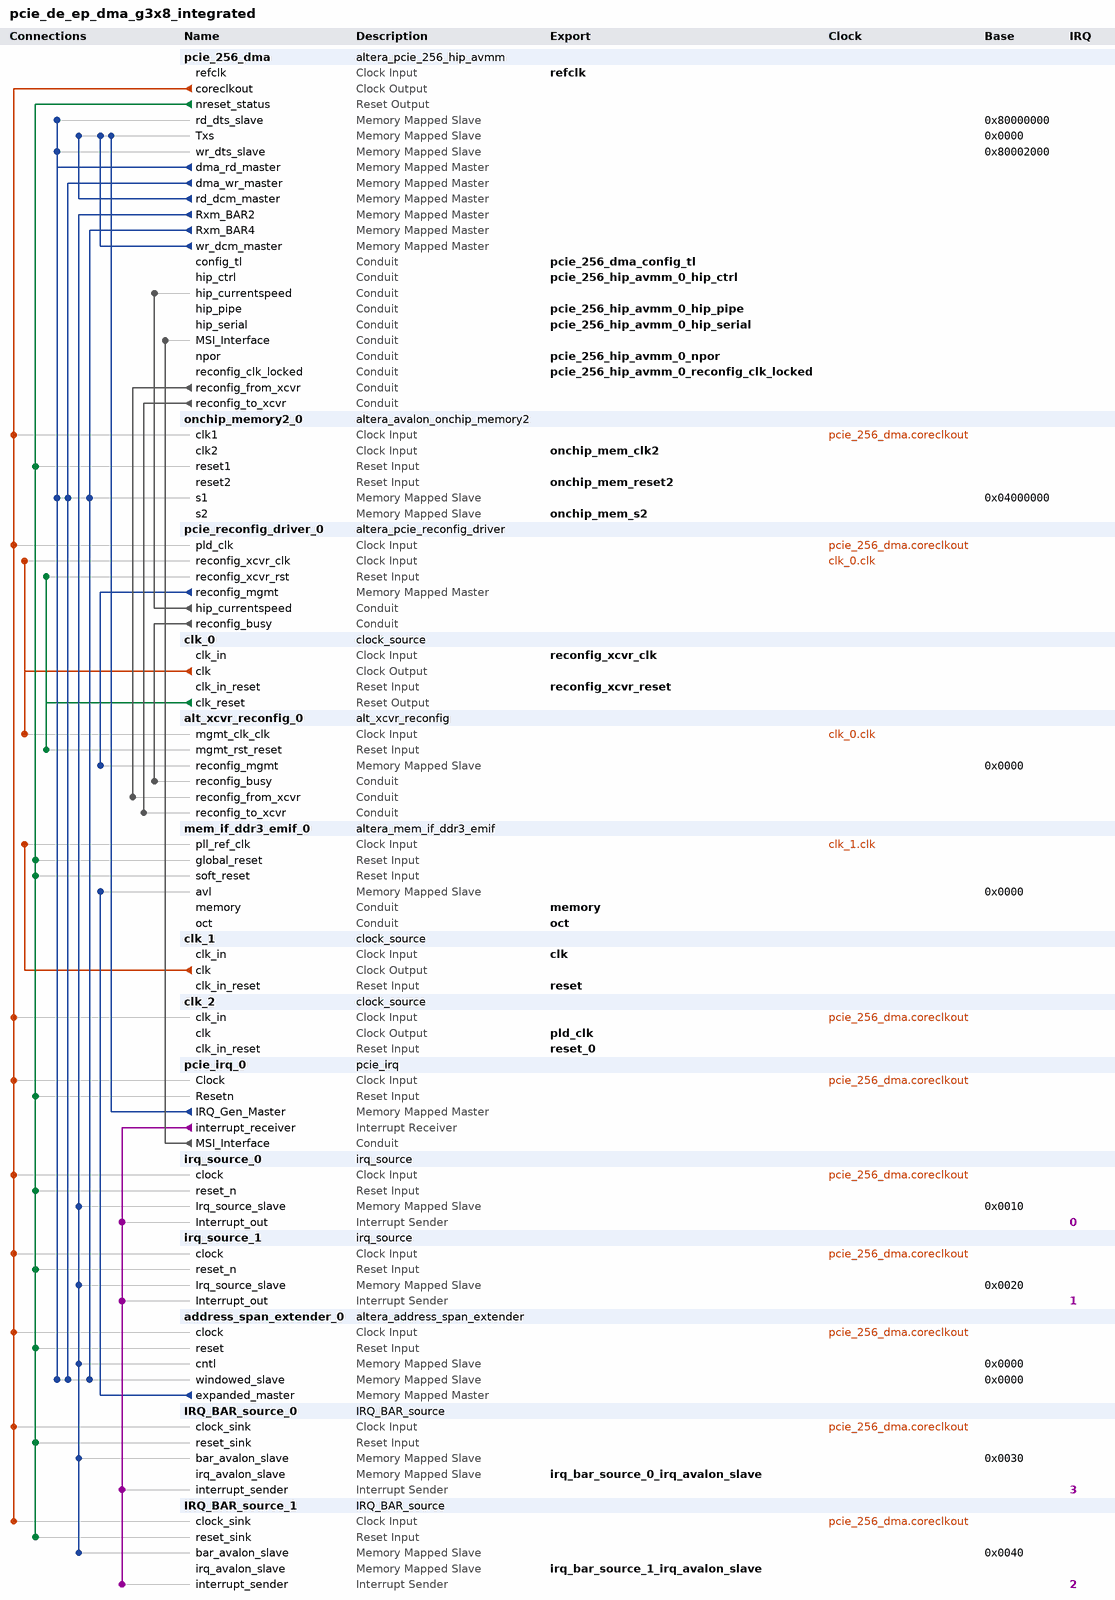
[diagram p0: system contents]
# Platform Designer (Qsys) system pcie_de_ep_dma_g3x8_integrated, Stratix V 5SGSMD5K2F40C2
# Parameters at their usual value, and those the tool derives, are not listed.
package require -exact qsys 17.0
create_system pcie_de_ep_dma_g3x8_integrated
set_project_property DEVICE_FAMILY {Stratix V}
set_project_property DEVICE 5SGSMD5K2F40C2

add_instance pcie_256_dma altera_pcie_256_hip_avmm 17.0
set_instance_parameter_value pcie_256_dma CB_P2A_AVALON_ADDR_B0 0x00000000
set_instance_parameter_value pcie_256_dma CB_P2A_AVALON_ADDR_B1 0x00000000
set_instance_parameter_value pcie_256_dma CB_P2A_AVALON_ADDR_B2 0x00000000
set_instance_parameter_value pcie_256_dma CB_P2A_AVALON_ADDR_B3 0x00000000
set_instance_parameter_value pcie_256_dma CB_P2A_AVALON_ADDR_B4 0x00000000
set_instance_parameter_value pcie_256_dma CB_P2A_AVALON_ADDR_B5 0x00000000
set_instance_parameter_value pcie_256_dma CB_P2A_FIXED_AVALON_ADDR_B0 0
set_instance_parameter_value pcie_256_dma CB_P2A_FIXED_AVALON_ADDR_B1 0
set_instance_parameter_value pcie_256_dma CB_P2A_FIXED_AVALON_ADDR_B2 0
set_instance_parameter_value pcie_256_dma CB_P2A_FIXED_AVALON_ADDR_B3 0
set_instance_parameter_value pcie_256_dma CB_P2A_FIXED_AVALON_ADDR_B4 0
set_instance_parameter_value pcie_256_dma CB_P2A_FIXED_AVALON_ADDR_B5 0
set_instance_parameter_value pcie_256_dma CG_COMMON_CLOCK_MODE 1
set_instance_parameter_value pcie_256_dma CG_RXM_IRQ_NUM 16
set_instance_parameter_value pcie_256_dma NUM_PREFETCH_MASTERS 1
set_instance_parameter_value pcie_256_dma RD_SLAVE_ADDRESS_MAP 32
set_instance_parameter_value pcie_256_dma SLAVE_ADDRESS_MAP_0 0
set_instance_parameter_value pcie_256_dma SLAVE_ADDRESS_MAP_1 0
set_instance_parameter_value pcie_256_dma SLAVE_ADDRESS_MAP_2 7
set_instance_parameter_value pcie_256_dma SLAVE_ADDRESS_MAP_3 0
set_instance_parameter_value pcie_256_dma SLAVE_ADDRESS_MAP_4 27
set_instance_parameter_value pcie_256_dma SLAVE_ADDRESS_MAP_5 0
set_instance_parameter_value pcie_256_dma TX_S_ADDR_WIDTH 32
set_instance_parameter_value pcie_256_dma WR_SLAVE_ADDRESS_MAP 27
set_instance_parameter_value pcie_256_dma add_pll_to_hip_coreclkout 0
set_instance_parameter_value pcie_256_dma advanced_default_hwtcl_atomic_malformed true
set_instance_parameter_value pcie_256_dma advanced_default_hwtcl_atomic_op_completer_32bit false
set_instance_parameter_value pcie_256_dma advanced_default_hwtcl_atomic_op_completer_64bit false
set_instance_parameter_value pcie_256_dma advanced_default_hwtcl_atomic_op_routing false
set_instance_parameter_value pcie_256_dma advanced_default_hwtcl_bridge_port_ssid_support false
set_instance_parameter_value pcie_256_dma advanced_default_hwtcl_bridge_port_vga_enable false
set_instance_parameter_value pcie_256_dma advanced_default_hwtcl_bypass_cdc false
set_instance_parameter_value pcie_256_dma advanced_default_hwtcl_cas_completer_128bit false
set_instance_parameter_value pcie_256_dma advanced_default_hwtcl_cdc_dummy_insert_limit 11
set_instance_parameter_value pcie_256_dma advanced_default_hwtcl_d0_pme false
set_instance_parameter_value pcie_256_dma advanced_default_hwtcl_d1_pme false
set_instance_parameter_value pcie_256_dma advanced_default_hwtcl_d1_support false
set_instance_parameter_value pcie_256_dma advanced_default_hwtcl_d2_pme false
set_instance_parameter_value pcie_256_dma advanced_default_hwtcl_d2_support false
set_instance_parameter_value pcie_256_dma advanced_default_hwtcl_d3_cold_pme false
set_instance_parameter_value pcie_256_dma advanced_default_hwtcl_d3_hot_pme false
set_instance_parameter_value pcie_256_dma advanced_default_hwtcl_data_pack_rx disable
set_instance_parameter_value pcie_256_dma advanced_default_hwtcl_deskew_comma com_deskw
set_instance_parameter_value pcie_256_dma advanced_default_hwtcl_device_number 0
set_instance_parameter_value pcie_256_dma advanced_default_hwtcl_disable_link_x2_support false
set_instance_parameter_value pcie_256_dma advanced_default_hwtcl_disable_snoop_packet false
set_instance_parameter_value pcie_256_dma advanced_default_hwtcl_ei_delay_powerdown_count 10
set_instance_parameter_value pcie_256_dma advanced_default_hwtcl_eie_before_nfts_count 4
set_instance_parameter_value pcie_256_dma advanced_default_hwtcl_enable_adapter_half_rate_mode false
set_instance_parameter_value pcie_256_dma advanced_default_hwtcl_enable_l1_aspm false
set_instance_parameter_value pcie_256_dma advanced_default_hwtcl_enable_rx_buffer_checking false
set_instance_parameter_value pcie_256_dma advanced_default_hwtcl_extended_format_field false
set_instance_parameter_value pcie_256_dma advanced_default_hwtcl_extended_tag_reset false
set_instance_parameter_value pcie_256_dma advanced_default_hwtcl_fc_init_timer 1024
set_instance_parameter_value pcie_256_dma advanced_default_hwtcl_flow_control_timeout_count 200
set_instance_parameter_value pcie_256_dma advanced_default_hwtcl_flow_control_update_count 30
set_instance_parameter_value pcie_256_dma advanced_default_hwtcl_flr_capability false
set_instance_parameter_value pcie_256_dma advanced_default_hwtcl_gen2_diffclock_nfts_count 255
set_instance_parameter_value pcie_256_dma advanced_default_hwtcl_gen2_sameclock_nfts_count 255
set_instance_parameter_value pcie_256_dma advanced_default_hwtcl_hot_plug_support 0
set_instance_parameter_value pcie_256_dma advanced_default_hwtcl_interrupt_pin inta
set_instance_parameter_value pcie_256_dma advanced_default_hwtcl_l01_entry_latency 31
set_instance_parameter_value pcie_256_dma advanced_default_hwtcl_l0_exit_latency_diffclock 6
set_instance_parameter_value pcie_256_dma advanced_default_hwtcl_l0_exit_latency_sameclock 6
set_instance_parameter_value pcie_256_dma advanced_default_hwtcl_l1_exit_latency_diffclock 0
set_instance_parameter_value pcie_256_dma advanced_default_hwtcl_l1_exit_latency_sameclock 0
set_instance_parameter_value pcie_256_dma advanced_default_hwtcl_low_priority_vc single_vc
set_instance_parameter_value pcie_256_dma advanced_default_hwtcl_ltr_mechanism false
set_instance_parameter_value pcie_256_dma advanced_default_hwtcl_ltssm_1ms_timeout disable
set_instance_parameter_value pcie_256_dma advanced_default_hwtcl_ltssm_freqlocked_check disable
set_instance_parameter_value pcie_256_dma advanced_default_hwtcl_maximum_current 0
set_instance_parameter_value pcie_256_dma advanced_default_hwtcl_no_command_completed true
set_instance_parameter_value pcie_256_dma advanced_default_hwtcl_no_soft_reset false
set_instance_parameter_value pcie_256_dma advanced_default_hwtcl_pclk_out_sel pclk
set_instance_parameter_value pcie_256_dma advanced_default_hwtcl_pipex1_debug_sel disable
set_instance_parameter_value pcie_256_dma advanced_default_hwtcl_register_pipe_signals false
set_instance_parameter_value pcie_256_dma advanced_default_hwtcl_reserved_debug 0
set_instance_parameter_value pcie_256_dma advanced_default_hwtcl_retry_buffer_last_active_address 2047
set_instance_parameter_value pcie_256_dma advanced_default_hwtcl_rx_l0s_count_idl 0
set_instance_parameter_value pcie_256_dma advanced_default_hwtcl_set_l0s 0
set_instance_parameter_value pcie_256_dma advanced_default_hwtcl_skp_os_gen3_count 0
set_instance_parameter_value pcie_256_dma advanced_default_hwtcl_skp_os_schedule_count 0
set_instance_parameter_value pcie_256_dma advanced_default_hwtcl_ssid 0
set_instance_parameter_value pcie_256_dma advanced_default_hwtcl_ssvid 0
set_instance_parameter_value pcie_256_dma advanced_default_hwtcl_tph_completer false
set_instance_parameter_value pcie_256_dma advanced_default_hwtcl_tx_cdc_almost_empty 5
set_instance_parameter_value pcie_256_dma advanced_default_hwtcl_vc0_clk_enable true
set_instance_parameter_value pcie_256_dma advanced_default_hwtcl_wrong_device_id disable
set_instance_parameter_value pcie_256_dma advanced_default_parameter_override 0
set_instance_parameter_value pcie_256_dma altpcie_avmm_hwtcl 1
set_instance_parameter_value pcie_256_dma app_interface_width_hwtcl 256
set_instance_parameter_value pcie_256_dma av_rpre_emph_a_val_hwtcl 12
set_instance_parameter_value pcie_256_dma av_rpre_emph_b_val_hwtcl 0
set_instance_parameter_value pcie_256_dma av_rpre_emph_c_val_hwtcl 19
set_instance_parameter_value pcie_256_dma av_rpre_emph_d_val_hwtcl 13
set_instance_parameter_value pcie_256_dma av_rpre_emph_e_val_hwtcl 21
set_instance_parameter_value pcie_256_dma av_rvod_sel_a_val_hwtcl 42
set_instance_parameter_value pcie_256_dma av_rvod_sel_b_val_hwtcl 30
set_instance_parameter_value pcie_256_dma av_rvod_sel_c_val_hwtcl 43
set_instance_parameter_value pcie_256_dma av_rvod_sel_d_val_hwtcl 43
set_instance_parameter_value pcie_256_dma av_rvod_sel_e_val_hwtcl 9
set_instance_parameter_value pcie_256_dma avmm_width_hwtcl 256
set_instance_parameter_value pcie_256_dma bar0_type_hwtcl 64
set_instance_parameter_value pcie_256_dma bar1_type_hwtcl 1
set_instance_parameter_value pcie_256_dma bar2_type_hwtcl 32
set_instance_parameter_value pcie_256_dma bar3_type_hwtcl 1
set_instance_parameter_value pcie_256_dma bar4_type_hwtcl 32
set_instance_parameter_value pcie_256_dma bar5_type_hwtcl 32
set_instance_parameter_value pcie_256_dma cdc_dummy_insert_limit_advanced_default_hwtcl 11
set_instance_parameter_value pcie_256_dma class_code_hwtcl 0
set_instance_parameter_value pcie_256_dma completion_timeout_hwtcl ABCD
set_instance_parameter_value pcie_256_dma cv_rpre_emph_a_val_hwtcl 11
set_instance_parameter_value pcie_256_dma cv_rpre_emph_b_val_hwtcl 0
set_instance_parameter_value pcie_256_dma cv_rpre_emph_c_val_hwtcl 22
set_instance_parameter_value pcie_256_dma cv_rpre_emph_d_val_hwtcl 12
set_instance_parameter_value pcie_256_dma cv_rpre_emph_e_val_hwtcl 21
set_instance_parameter_value pcie_256_dma cv_rvod_sel_a_val_hwtcl 50
set_instance_parameter_value pcie_256_dma cv_rvod_sel_b_val_hwtcl 34
set_instance_parameter_value pcie_256_dma cv_rvod_sel_c_val_hwtcl 50
set_instance_parameter_value pcie_256_dma cv_rvod_sel_d_val_hwtcl 50
set_instance_parameter_value pcie_256_dma cv_rvod_sel_e_val_hwtcl 9
set_instance_parameter_value pcie_256_dma d0_pme_advanced_default_hwtcl false
set_instance_parameter_value pcie_256_dma d1_pme_advanced_default_hwtcl false
set_instance_parameter_value pcie_256_dma d1_support_advanced_default_hwtcl false
set_instance_parameter_value pcie_256_dma d2_pme_advanced_default_hwtcl false
set_instance_parameter_value pcie_256_dma d2_support_advanced_default_hwtcl false
set_instance_parameter_value pcie_256_dma d3_cold_pme_advanced_default_hwtcl false
set_instance_parameter_value pcie_256_dma d3_hot_pme_advanced_default_hwtcl false
set_instance_parameter_value pcie_256_dma deemphasis_enable_advanced_default_hwtcl false
set_instance_parameter_value pcie_256_dma device_id_hwtcl 57347
set_instance_parameter_value pcie_256_dma device_number_advanced_default_hwtcl 0
set_instance_parameter_value pcie_256_dma diffclock_nfts_count_advanced_default_hwtcl 255
set_instance_parameter_value pcie_256_dma disable_link_x2_support_advanced_default_hwtcl false
set_instance_parameter_value pcie_256_dma dll_active_report_support_hwtcl 0
set_instance_parameter_value pcie_256_dma dma_use_scfifo_ext_hwtcl 0
set_instance_parameter_value pcie_256_dma ecrc_check_capable_hwtcl 0
set_instance_parameter_value pcie_256_dma ecrc_gen_capable_hwtcl 0
set_instance_parameter_value pcie_256_dma ei_delay_powerdown_count_advanced_default_hwtcl 10
set_instance_parameter_value pcie_256_dma eie_before_nfts_count_advanced_default_hwtcl 4
set_instance_parameter_value pcie_256_dma enable_completion_timeout_disable_hwtcl 1
set_instance_parameter_value pcie_256_dma enable_cra_hwtcl 1
set_instance_parameter_value pcie_256_dma enable_function_msix_support_hwtcl 0
set_instance_parameter_value pcie_256_dma enable_l1_aspm_advanced_default_hwtcl false
set_instance_parameter_value pcie_256_dma enable_pcisigtest_hwtcl 0
set_instance_parameter_value pcie_256_dma enable_power_on_rst_pulse_hwtcl 0
set_instance_parameter_value pcie_256_dma enable_rx_buffer_checking_advanced_default_hwtcl false
set_instance_parameter_value pcie_256_dma enable_rxm_burst_hwtcl 0
set_instance_parameter_value pcie_256_dma enable_slot_register_hwtcl 0
set_instance_parameter_value pcie_256_dma enable_tl_only_sim_hwtcl 0
set_instance_parameter_value pcie_256_dma endpoint_l0_latency_hwtcl 0
set_instance_parameter_value pcie_256_dma endpoint_l1_latency_hwtcl 0
set_instance_parameter_value pcie_256_dma expansion_base_address_register_hwtcl 0
set_instance_parameter_value pcie_256_dma extend_tag_field_hwtcl 32
set_instance_parameter_value pcie_256_dma fc_init_timer_advanced_default_hwtcl 1024
set_instance_parameter_value pcie_256_dma fixed_address_mode 0
set_instance_parameter_value pcie_256_dma flow_control_timeout_count_advanced_default_hwtcl 200
set_instance_parameter_value pcie_256_dma flow_control_update_count_advanced_default_hwtcl 30
set_instance_parameter_value pcie_256_dma force_hrc 0
set_instance_parameter_value pcie_256_dma force_src 0
set_instance_parameter_value pcie_256_dma gen123_lane_rate_mode_hwtcl {Gen3 (8.0 Gbps)}
set_instance_parameter_value pcie_256_dma gen2_diffclock_nfts_count_advanced_default_hwtcl 255
set_instance_parameter_value pcie_256_dma gen2_sameclock_nfts_count_advanced_default_hwtcl 255
set_instance_parameter_value pcie_256_dma gen3_rxfreqlock_counter_hwtcl 0
set_instance_parameter_value pcie_256_dma generate_sdc_for_qsys_design_example 1
set_instance_parameter_value pcie_256_dma hip_reconfig_hwtcl 0
set_instance_parameter_value pcie_256_dma hip_tag_checking_hwtcl 1
set_instance_parameter_value pcie_256_dma hot_plug_support_advanced_default_hwtcl 0
set_instance_parameter_value pcie_256_dma hwtcl_override_g2_txvod 1
set_instance_parameter_value pcie_256_dma in_cvp_mode_hwtcl 0
set_instance_parameter_value pcie_256_dma indicator_advanced_default_hwtcl 0
set_instance_parameter_value pcie_256_dma internal_controller_hwtcl 1
set_instance_parameter_value pcie_256_dma io_window_addr_width_hwtcl 0
set_instance_parameter_value pcie_256_dma l01_entry_latency_advanced_default_hwtcl 31
set_instance_parameter_value pcie_256_dma l0_exit_latency_diffclock_advanced_default_hwtcl 6
set_instance_parameter_value pcie_256_dma l0_exit_latency_sameclock_advanced_default_hwtcl 6
set_instance_parameter_value pcie_256_dma l1_exit_latency_diffclock_advanced_default_hwtcl 0
set_instance_parameter_value pcie_256_dma l1_exit_latency_sameclock_advanced_default_hwtcl 0
set_instance_parameter_value pcie_256_dma l2_async_logic_advanced_default_hwtcl disable
set_instance_parameter_value pcie_256_dma lane_mask_hwtcl x8
set_instance_parameter_value pcie_256_dma low_priority_vc_advanced_default_hwtcl single_vc
set_instance_parameter_value pcie_256_dma max_payload_size_hwtcl 256
set_instance_parameter_value pcie_256_dma msi_64bit_addressing_capable_hwtcl true
set_instance_parameter_value pcie_256_dma msi_masking_capable_hwtcl false
set_instance_parameter_value pcie_256_dma msi_multi_message_capable_hwtcl 4
set_instance_parameter_value pcie_256_dma msi_support_hwtcl true
set_instance_parameter_value pcie_256_dma msix_pba_bir_hwtcl 0
set_instance_parameter_value pcie_256_dma msix_pba_offset_hwtcl 0
set_instance_parameter_value pcie_256_dma msix_table_bir_hwtcl 0
set_instance_parameter_value pcie_256_dma msix_table_offset_hwtcl 0
set_instance_parameter_value pcie_256_dma msix_table_size_hwtcl 0
set_instance_parameter_value pcie_256_dma no_command_completed_advanced_default_hwtcl false
set_instance_parameter_value pcie_256_dma no_soft_reset_advanced_default_hwtcl false
set_instance_parameter_value pcie_256_dma override_rxbuffer_cred_preset 0
set_instance_parameter_value pcie_256_dma override_tbpartner_driver_setting_hwtcl 0
set_instance_parameter_value pcie_256_dma pcie_inspector_hwtcl 0
set_instance_parameter_value pcie_256_dma pcie_qsys 1
set_instance_parameter_value pcie_256_dma pclk_out_sel_advanced_default_hwtcl pclk
set_instance_parameter_value pcie_256_dma pipex1_debug_sel_advanced_default_hwtcl disable
set_instance_parameter_value pcie_256_dma pll_refclk_freq_hwtcl {100 MHz}
set_instance_parameter_value pcie_256_dma port_link_number_hwtcl 1
set_instance_parameter_value pcie_256_dma port_type_hwtcl {Native endpoint}
set_instance_parameter_value pcie_256_dma prefetchable_mem_window_addr_width_hwtcl 0
set_instance_parameter_value pcie_256_dma register_pipe_signals_advanced_default_hwtcl true
set_instance_parameter_value pcie_256_dma reserved_debug_advanced_default_hwtcl 0
set_instance_parameter_value pcie_256_dma retry_buffer_last_active_address_advanced_default_hwtcl 255
set_instance_parameter_value pcie_256_dma revision_id_hwtcl 1
set_instance_parameter_value pcie_256_dma rpre_emph_a_val_hwtcl 9
set_instance_parameter_value pcie_256_dma rpre_emph_b_val_hwtcl 0
set_instance_parameter_value pcie_256_dma rpre_emph_c_val_hwtcl 16
set_instance_parameter_value pcie_256_dma rpre_emph_d_val_hwtcl 13
set_instance_parameter_value pcie_256_dma rpre_emph_e_val_hwtcl 5
set_instance_parameter_value pcie_256_dma rvod_sel_a_val_hwtcl 42
set_instance_parameter_value pcie_256_dma rvod_sel_b_val_hwtcl 38
set_instance_parameter_value pcie_256_dma rvod_sel_c_val_hwtcl 38
set_instance_parameter_value pcie_256_dma rvod_sel_d_val_hwtcl 43
set_instance_parameter_value pcie_256_dma rvod_sel_e_val_hwtcl 15
set_instance_parameter_value pcie_256_dma rx_cdc_almost_full_advanced_default_hwtcl 12
set_instance_parameter_value pcie_256_dma rx_l0s_count_idl_advanced_default_hwtcl 0
set_instance_parameter_value pcie_256_dma rxbuffer_rxreq_hwtcl Low
set_instance_parameter_value pcie_256_dma sameclock_nfts_count_advanced_default_hwtcl 255
set_instance_parameter_value pcie_256_dma serial_sim_hwtcl 1
set_instance_parameter_value pcie_256_dma set_pld_clk_x1_625MHz_hwtcl 0
set_instance_parameter_value pcie_256_dma set_pll_coreclkout_slack 10
set_instance_parameter_value pcie_256_dma skp_os_schedule_count_advanced_default_hwtcl 0
set_instance_parameter_value pcie_256_dma slot_number_hwtcl 0
set_instance_parameter_value pcie_256_dma slot_power_limit_hwtcl 0
set_instance_parameter_value pcie_256_dma slot_power_scale_hwtcl 0
set_instance_parameter_value pcie_256_dma slotclkcfg_hwtcl 1
set_instance_parameter_value pcie_256_dma subsystem_device_id_hwtcl 47202
set_instance_parameter_value pcie_256_dma subsystem_vendor_id_hwtcl 1
set_instance_parameter_value pcie_256_dma surprise_down_error_support_hwtcl 0
set_instance_parameter_value pcie_256_dma tlp_insp_trg_dw0_hwtcl 1
set_instance_parameter_value pcie_256_dma tlp_insp_trg_dw1_hwtcl 0
set_instance_parameter_value pcie_256_dma tlp_insp_trg_dw2_hwtcl 0
set_instance_parameter_value pcie_256_dma tlp_insp_trg_dw3_hwtcl 0
set_instance_parameter_value pcie_256_dma tlp_inspector_hwtcl 0
set_instance_parameter_value pcie_256_dma tlp_inspector_use_signal_probe_hwtcl 0
set_instance_parameter_value pcie_256_dma tx_cdc_almost_empty_advanced_default_hwtcl 5
set_instance_parameter_value pcie_256_dma tx_cdc_almost_full_advanced_default_hwtcl 11
set_instance_parameter_value pcie_256_dma use_aer_hwtcl 0
set_instance_parameter_value pcie_256_dma use_ast_parity 0
set_instance_parameter_value pcie_256_dma use_atx_pll_hwtcl 0
set_instance_parameter_value pcie_256_dma use_crc_forwarding_hwtcl 0
set_instance_parameter_value pcie_256_dma use_cvp_update_core_pof_hwtcl 0
set_instance_parameter_value pcie_256_dma use_rx_st_be_hwtcl 0
set_instance_parameter_value pcie_256_dma use_tl_cfg_sync_advanced_default_hwtcl 1
set_instance_parameter_value pcie_256_dma vc0_clk_enable_advanced_default_hwtcl true
set_instance_parameter_value pcie_256_dma vendor_id_hwtcl 4466
set_instance_parameter_value pcie_256_dma vsec_id_hwtcl 40960
set_instance_parameter_value pcie_256_dma vsec_rev_hwtcl 0

add_instance onchip_memory2_0 altera_avalon_onchip_memory2 17.0
set_instance_parameter_value onchip_memory2_0 dataWidth 256
set_instance_parameter_value onchip_memory2_0 dualPort true
set_instance_parameter_value onchip_memory2_0 initMemContent true
set_instance_parameter_value onchip_memory2_0 initializationFileName onchip_mem
set_instance_parameter_value onchip_memory2_0 memorySize 262144
set_instance_parameter_value onchip_memory2_0 slave2Latency 2

add_instance pcie_reconfig_driver_0 altera_pcie_reconfig_driver 17.0
set_instance_parameter_value pcie_reconfig_driver_0 gen123_lane_rate_mode_hwtcl {Gen3 (8.0 Gbps)}
set_instance_parameter_value pcie_reconfig_driver_0 number_of_reconfig_interfaces 11

add_instance clk_0 clock_source 17.0
set_instance_parameter_value clk_0 clockFrequency 100000000

add_instance alt_xcvr_reconfig_0 alt_xcvr_reconfig 17.0
set_instance_parameter_value alt_xcvr_reconfig_0 device_family {Stratix V}
set_instance_parameter_value alt_xcvr_reconfig_0 enable_adce 1
set_instance_parameter_value alt_xcvr_reconfig_0 enable_analog 1
set_instance_parameter_value alt_xcvr_reconfig_0 number_of_reconfig_interfaces 11

add_instance mem_if_ddr3_emif_0 altera_mem_if_ddr3_emif 17.0
set_instance_parameter_value mem_if_ddr3_emif_0 AVL_MAX_SIZE 8
set_instance_parameter_value mem_if_ddr3_emif_0 CALIBRATION_MODE Skip
set_instance_parameter_value mem_if_ddr3_emif_0 CFG_REORDER_DATA false
set_instance_parameter_value mem_if_ddr3_emif_0 CPORT_TYPE_PORT Bidirectional,Bidirectional,Bidirectional,Bidirectional,Bidirectional,Bidirectional
set_instance_parameter_value mem_if_ddr3_emif_0 EXPORT_AFI_HALF_CLK false
set_instance_parameter_value mem_if_ddr3_emif_0 HARD_EMIF false
set_instance_parameter_value mem_if_ddr3_emif_0 MEM_BANKADDR_WIDTH 3
set_instance_parameter_value mem_if_ddr3_emif_0 MEM_CLK_FREQ 500.0
set_instance_parameter_value mem_if_ddr3_emif_0 MEM_CLK_FREQ_MAX 800.0
set_instance_parameter_value mem_if_ddr3_emif_0 MEM_COL_ADDR_WIDTH 10
set_instance_parameter_value mem_if_ddr3_emif_0 MEM_DQ_WIDTH 64
set_instance_parameter_value mem_if_ddr3_emif_0 MEM_DRV_STR RZQ/6
set_instance_parameter_value mem_if_ddr3_emif_0 MEM_FORMAT DISCRETE
set_instance_parameter_value mem_if_ddr3_emif_0 MEM_ROW_ADDR_WIDTH 14
set_instance_parameter_value mem_if_ddr3_emif_0 MEM_TCL 11
set_instance_parameter_value mem_if_ddr3_emif_0 MEM_TFAW_NS 30.0
set_instance_parameter_value mem_if_ddr3_emif_0 MEM_TMRD_CK 6
set_instance_parameter_value mem_if_ddr3_emif_0 MEM_TRAS_NS 35.0
set_instance_parameter_value mem_if_ddr3_emif_0 MEM_TRCD_NS 13.75
set_instance_parameter_value mem_if_ddr3_emif_0 MEM_TRFC_NS 110.0
set_instance_parameter_value mem_if_ddr3_emif_0 MEM_TRP_NS 13.75
set_instance_parameter_value mem_if_ddr3_emif_0 MEM_TRRD_NS 6.0
set_instance_parameter_value mem_if_ddr3_emif_0 MEM_TRTP_NS 7.5
set_instance_parameter_value mem_if_ddr3_emif_0 MEM_TWTR 6
set_instance_parameter_value mem_if_ddr3_emif_0 MEM_VENDOR Micron
set_instance_parameter_value mem_if_ddr3_emif_0 MEM_WTCL 8
set_instance_parameter_value mem_if_ddr3_emif_0 PLL_LOCATION Top_Bottom
set_instance_parameter_value mem_if_ddr3_emif_0 POWER_OF_TWO_BUS false
set_instance_parameter_value mem_if_ddr3_emif_0 PRIORITY_PORT 1,1,1,1,1,1
set_instance_parameter_value mem_if_ddr3_emif_0 RATE Half
set_instance_parameter_value mem_if_ddr3_emif_0 REF_CLK_FREQ 100.0
set_instance_parameter_value mem_if_ddr3_emif_0 SPEED_GRADE 1
set_instance_parameter_value mem_if_ddr3_emif_0 TIMING_BOARD_AC_SKEW 0.02
set_instance_parameter_value mem_if_ddr3_emif_0 TIMING_BOARD_AC_TO_CK_SKEW 0.0
set_instance_parameter_value mem_if_ddr3_emif_0 TIMING_BOARD_DQ_TO_DQS_SKEW 0.0
set_instance_parameter_value mem_if_ddr3_emif_0 TIMING_BOARD_MAX_CK_DELAY 0.6
set_instance_parameter_value mem_if_ddr3_emif_0 TIMING_BOARD_MAX_DQS_DELAY 0.6
set_instance_parameter_value mem_if_ddr3_emif_0 TIMING_BOARD_SKEW_BETWEEN_DQS 0.02
set_instance_parameter_value mem_if_ddr3_emif_0 TIMING_BOARD_SKEW_CKDQS_DIMM_MAX 0.01
set_instance_parameter_value mem_if_ddr3_emif_0 TIMING_BOARD_SKEW_CKDQS_DIMM_MIN -0.01
set_instance_parameter_value mem_if_ddr3_emif_0 TIMING_BOARD_SKEW_WITHIN_DQS 0.02
set_instance_parameter_value mem_if_ddr3_emif_0 TIMING_TDH 45
set_instance_parameter_value mem_if_ddr3_emif_0 TIMING_TDQSCK 255
set_instance_parameter_value mem_if_ddr3_emif_0 TIMING_TDQSQ 100
set_instance_parameter_value mem_if_ddr3_emif_0 TIMING_TDQSS 0.27
set_instance_parameter_value mem_if_ddr3_emif_0 TIMING_TDS 10
set_instance_parameter_value mem_if_ddr3_emif_0 TIMING_TDSH 0.18
set_instance_parameter_value mem_if_ddr3_emif_0 TIMING_TDSS 0.18
set_instance_parameter_value mem_if_ddr3_emif_0 TIMING_TIH 120
set_instance_parameter_value mem_if_ddr3_emif_0 TIMING_TIS 170
set_instance_parameter_value mem_if_ddr3_emif_0 TIMING_TQSH 0.4
set_instance_parameter_value mem_if_ddr3_emif_0 USER_DEBUG_LEVEL 1

add_instance clk_1 clock_source 17.0
set_instance_parameter_value clk_1 clockFrequency 100000000

add_instance clk_2 clock_source 17.0
set_instance_parameter_value clk_2 clockFrequency 50000000

add_instance pcie_irq_0 pcie_irq 1.0

add_instance irq_source_0 irq_source 1.0

add_instance irq_source_1 irq_source 1.0

add_instance address_span_extender_0 altera_address_span_extender 17.0
set_instance_parameter_value address_span_extender_0 BURSTCOUNT_WIDTH 1
set_instance_parameter_value address_span_extender_0 DATA_WIDTH 256
set_instance_parameter_value address_span_extender_0 ENABLE_SLAVE_PORT true
set_instance_parameter_value address_span_extender_0 MASTER_ADDRESS_DEF 0
set_instance_parameter_value address_span_extender_0 MASTER_ADDRESS_WIDTH 30
set_instance_parameter_value address_span_extender_0 MAX_PENDING_READS 1
set_instance_parameter_value address_span_extender_0 SLAVE_ADDRESS_WIDTH 21

add_instance IRQ_BAR_source_0 IRQ_BAR_source 1.0

add_instance IRQ_BAR_source_1 IRQ_BAR_source 1.0

# connections
add_connection clk_0.clk alt_xcvr_reconfig_0.mgmt_clk_clk clock
add_connection clk_0.clk pcie_reconfig_driver_0.reconfig_xcvr_clk clock
add_connection clk_1.clk mem_if_ddr3_emif_0.pll_ref_clk clock
add_connection pcie_256_dma.coreclkout address_span_extender_0.clock clock
add_connection pcie_256_dma.coreclkout clk_2.clk_in clock
add_connection pcie_256_dma.coreclkout IRQ_BAR_source_0.clock_sink clock
add_connection pcie_256_dma.coreclkout IRQ_BAR_source_1.clock_sink clock
add_connection pcie_256_dma.coreclkout irq_source_0.clock clock
add_connection pcie_256_dma.coreclkout irq_source_1.clock clock
add_connection pcie_256_dma.coreclkout onchip_memory2_0.clk1 clock
add_connection pcie_256_dma.coreclkout pcie_irq_0.Clock clock
add_connection pcie_256_dma.coreclkout pcie_reconfig_driver_0.pld_clk clock
add_connection clk_0.clk_reset alt_xcvr_reconfig_0.mgmt_rst_reset reset
add_connection clk_0.clk_reset pcie_reconfig_driver_0.reconfig_xcvr_rst reset
add_connection pcie_256_dma.nreset_status address_span_extender_0.reset reset
add_connection pcie_256_dma.nreset_status IRQ_BAR_source_0.reset_sink reset
add_connection pcie_256_dma.nreset_status IRQ_BAR_source_1.reset_sink reset
add_connection pcie_256_dma.nreset_status irq_source_0.reset_n reset
add_connection pcie_256_dma.nreset_status irq_source_1.reset_n reset
add_connection pcie_256_dma.nreset_status mem_if_ddr3_emif_0.global_reset reset
add_connection pcie_256_dma.nreset_status mem_if_ddr3_emif_0.soft_reset reset
add_connection pcie_256_dma.nreset_status onchip_memory2_0.reset1 reset
add_connection pcie_256_dma.nreset_status pcie_irq_0.Resetn reset
add_connection address_span_extender_0.expanded_master mem_if_ddr3_emif_0.avl avalon
set_connection_parameter_value address_span_extender_0.expanded_master/mem_if_ddr3_emif_0.avl baseAddress 0x0000
add_connection pcie_256_dma.dma_rd_master address_span_extender_0.windowed_slave avalon
set_connection_parameter_value pcie_256_dma.dma_rd_master/address_span_extender_0.windowed_slave baseAddress 0x0000
add_connection pcie_256_dma.dma_rd_master onchip_memory2_0.s1 avalon
set_connection_parameter_value pcie_256_dma.dma_rd_master/onchip_memory2_0.s1 baseAddress 0x04000000
add_connection pcie_256_dma.dma_rd_master pcie_256_dma.rd_dts_slave avalon
set_connection_parameter_value pcie_256_dma.dma_rd_master/pcie_256_dma.rd_dts_slave baseAddress 0x80000000
add_connection pcie_256_dma.dma_rd_master pcie_256_dma.wr_dts_slave avalon
set_connection_parameter_value pcie_256_dma.dma_rd_master/pcie_256_dma.wr_dts_slave baseAddress 0x80002000
add_connection pcie_256_dma.dma_wr_master address_span_extender_0.windowed_slave avalon
set_connection_parameter_value pcie_256_dma.dma_wr_master/address_span_extender_0.windowed_slave baseAddress 0x0000
add_connection pcie_256_dma.dma_wr_master onchip_memory2_0.s1 avalon
set_connection_parameter_value pcie_256_dma.dma_wr_master/onchip_memory2_0.s1 baseAddress 0x04000000
add_connection pcie_256_dma.rd_dcm_master pcie_256_dma.Txs avalon
set_connection_parameter_value pcie_256_dma.rd_dcm_master/pcie_256_dma.Txs baseAddress 0x0000
add_connection pcie_256_dma.Rxm_BAR2 address_span_extender_0.cntl avalon
set_connection_parameter_value pcie_256_dma.Rxm_BAR2/address_span_extender_0.cntl baseAddress 0x0000
add_connection pcie_256_dma.Rxm_BAR2 IRQ_BAR_source_0.bar_avalon_slave avalon
set_connection_parameter_value pcie_256_dma.Rxm_BAR2/IRQ_BAR_source_0.bar_avalon_slave baseAddress 0x0030
add_connection pcie_256_dma.Rxm_BAR2 IRQ_BAR_source_1.bar_avalon_slave avalon
set_connection_parameter_value pcie_256_dma.Rxm_BAR2/IRQ_BAR_source_1.bar_avalon_slave baseAddress 0x0040
add_connection pcie_256_dma.Rxm_BAR2 irq_source_0.Irq_source_slave avalon
set_connection_parameter_value pcie_256_dma.Rxm_BAR2/irq_source_0.Irq_source_slave baseAddress 0x0010
add_connection pcie_256_dma.Rxm_BAR2 irq_source_1.Irq_source_slave avalon
set_connection_parameter_value pcie_256_dma.Rxm_BAR2/irq_source_1.Irq_source_slave baseAddress 0x0020
add_connection pcie_256_dma.Rxm_BAR4 address_span_extender_0.windowed_slave avalon
set_connection_parameter_value pcie_256_dma.Rxm_BAR4/address_span_extender_0.windowed_slave baseAddress 0x0000
add_connection pcie_256_dma.Rxm_BAR4 onchip_memory2_0.s1 avalon
set_connection_parameter_value pcie_256_dma.Rxm_BAR4/onchip_memory2_0.s1 baseAddress 0x04000000
add_connection pcie_256_dma.wr_dcm_master pcie_256_dma.Txs avalon
set_connection_parameter_value pcie_256_dma.wr_dcm_master/pcie_256_dma.Txs baseAddress 0x0000
add_connection pcie_irq_0.IRQ_Gen_Master pcie_256_dma.Txs avalon
set_connection_parameter_value pcie_irq_0.IRQ_Gen_Master/pcie_256_dma.Txs baseAddress 0x0000
add_connection pcie_reconfig_driver_0.reconfig_mgmt alt_xcvr_reconfig_0.reconfig_mgmt avalon
set_connection_parameter_value pcie_reconfig_driver_0.reconfig_mgmt/alt_xcvr_reconfig_0.reconfig_mgmt baseAddress 0x0000
add_connection pcie_256_dma.reconfig_from_xcvr alt_xcvr_reconfig_0.reconfig_from_xcvr conduit
add_connection pcie_256_dma.reconfig_to_xcvr alt_xcvr_reconfig_0.reconfig_to_xcvr conduit
add_connection pcie_irq_0.MSI_Interface pcie_256_dma.MSI_Interface conduit
add_connection pcie_reconfig_driver_0.hip_currentspeed pcie_256_dma.hip_currentspeed conduit
add_connection pcie_reconfig_driver_0.reconfig_busy alt_xcvr_reconfig_0.reconfig_busy conduit
add_connection pcie_irq_0.interrupt_receiver IRQ_BAR_source_0.interrupt_sender interrupt
set_connection_parameter_value pcie_irq_0.interrupt_receiver/IRQ_BAR_source_0.interrupt_sender irqNumber 3
add_connection pcie_irq_0.interrupt_receiver IRQ_BAR_source_1.interrupt_sender interrupt
set_connection_parameter_value pcie_irq_0.interrupt_receiver/IRQ_BAR_source_1.interrupt_sender irqNumber 2
add_connection pcie_irq_0.interrupt_receiver irq_source_0.Interrupt_out interrupt
set_connection_parameter_value pcie_irq_0.interrupt_receiver/irq_source_0.Interrupt_out irqNumber 0
add_connection pcie_irq_0.interrupt_receiver irq_source_1.Interrupt_out interrupt
set_connection_parameter_value pcie_irq_0.interrupt_receiver/irq_source_1.Interrupt_out irqNumber 1

# exported interfaces
add_interface clk clock sink
set_interface_property clk EXPORT_OF clk_1.clk_in
add_interface irq_bar_source_0_irq_avalon_slave avalon slave
set_interface_property irq_bar_source_0_irq_avalon_slave EXPORT_OF IRQ_BAR_source_0.irq_avalon_slave
add_interface irq_bar_source_1_irq_avalon_slave avalon slave
set_interface_property irq_bar_source_1_irq_avalon_slave EXPORT_OF IRQ_BAR_source_1.irq_avalon_slave
add_interface memory conduit end
set_interface_property memory EXPORT_OF mem_if_ddr3_emif_0.memory
add_interface oct conduit end
set_interface_property oct EXPORT_OF mem_if_ddr3_emif_0.oct
add_interface onchip_mem_clk2 clock sink
set_interface_property onchip_mem_clk2 EXPORT_OF onchip_memory2_0.clk2
add_interface onchip_mem_reset2 reset sink
set_interface_property onchip_mem_reset2 EXPORT_OF onchip_memory2_0.reset2
add_interface onchip_mem_s2 avalon slave
set_interface_property onchip_mem_s2 EXPORT_OF onchip_memory2_0.s2
add_interface pcie_256_dma_config_tl conduit end
set_interface_property pcie_256_dma_config_tl EXPORT_OF pcie_256_dma.config_tl
add_interface pcie_256_hip_avmm_0_hip_ctrl conduit end
set_interface_property pcie_256_hip_avmm_0_hip_ctrl EXPORT_OF pcie_256_dma.hip_ctrl
add_interface pcie_256_hip_avmm_0_hip_pipe conduit end
set_interface_property pcie_256_hip_avmm_0_hip_pipe EXPORT_OF pcie_256_dma.hip_pipe
add_interface pcie_256_hip_avmm_0_hip_serial conduit end
set_interface_property pcie_256_hip_avmm_0_hip_serial EXPORT_OF pcie_256_dma.hip_serial
add_interface pcie_256_hip_avmm_0_npor conduit end
set_interface_property pcie_256_hip_avmm_0_npor EXPORT_OF pcie_256_dma.npor
add_interface pcie_256_hip_avmm_0_reconfig_clk_locked conduit end
set_interface_property pcie_256_hip_avmm_0_reconfig_clk_locked EXPORT_OF pcie_256_dma.reconfig_clk_locked
add_interface pld_clk clock source
set_interface_property pld_clk EXPORT_OF clk_2.clk
add_interface reconfig_xcvr_clk clock sink
set_interface_property reconfig_xcvr_clk EXPORT_OF clk_0.clk_in
add_interface reconfig_xcvr_reset reset sink
set_interface_property reconfig_xcvr_reset EXPORT_OF clk_0.clk_in_reset
add_interface refclk clock sink
set_interface_property refclk EXPORT_OF pcie_256_dma.refclk
add_interface reset reset sink
set_interface_property reset EXPORT_OF clk_1.clk_in_reset
add_interface reset_0 reset sink
set_interface_property reset_0 EXPORT_OF clk_2.clk_in_reset

set_interconnect_requirement {$system} qsys_mm.clockCrossingAdapter HANDSHAKE
set_interconnect_requirement {$system} qsys_mm.maxAdditionalLatency 1

save_system pcie_de_ep_dma_g3x8_integrated.qsys
